# Altium schematic sheet BusDistribution.SchDoc
size A
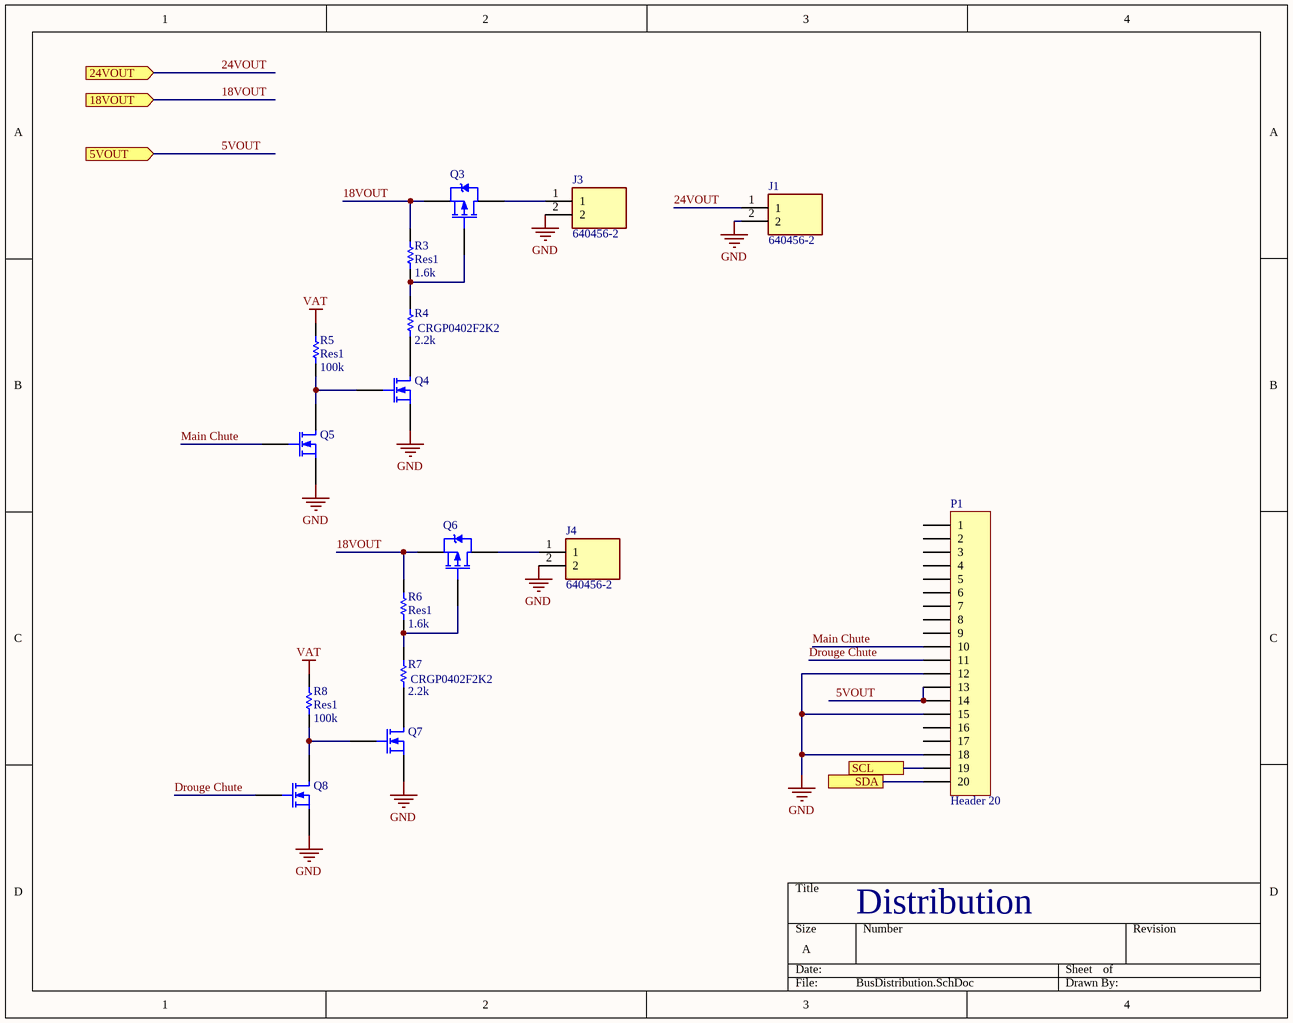
[diagram p0: BusDistribution.SchDoc]

## Parts
J1  640456-2  [16404562]
J3  640456-2  [16404562]
J4  640456-2  [16404562]
P1  Header 20  [HDR1X20]
Q3  MED power PMOS  [SOT23_L]  (value not drawn)
Q4  Low Power NMOS  [SOT23_L]  (value not drawn)
Q5  Low power NMOS  [SOT23_L]  (value not drawn)
Q6  MED power PMOS  [SOT23_L]  (value not drawn)
Q7  Low Power NMOS  [SOT23_L]  (value not drawn)
Q8  Low Power NMOS  [SOT23_L]  (value not drawn)
R3  Res1  value 1.6k  [0402]
R4  CRGP0402F2K2  value 2.2k  [0402]
R5  Res1  value 100k  [0402]
R6  Res1  value 1.6k  [0402]
R7  CRGP0402F2K2  value 2.2k  [0402]
R8  Res1  value 100k  [0402]

## Ports
5VOUT (in), 18VOUT (in), 24VOUT (in), SCL, SDA

## Nets
GND: J1.2 J3.2 J4.2 P1.12 P1.15 P1.18 Q4.3(S) Q5.3(S) Q7.3(S) Q8.3(S)
VAT: R5.2 R8.2
5VOUT: P1.13 P1.14 ; port 5VOUT
18VOUT: Q3.3(S) Q6.3(S) R3.2 R6.2 ; port 18VOUT
24VOUT: J1.1 ; port 24VOUT
Drouge Chute: P1.11 Q8.2(G)
Main Chute: P1.10 Q5.2(G)
SCL: P1.19 ; port SCL
SDA: P1.20 ; port SDA
NetJ3_1: J3.1 Q3.2(D)
NetJ4_1: J4.1 Q6.2(D)
NetQ3_1: Q3.1(G) R3.1 R4.2
NetQ4_1: Q4.1(D) R4.1
NetQ4_2: Q4.2(G) Q5.1(D) R5.1
NetQ6_1: Q6.1(G) R6.1 R7.2
NetQ7_1: Q7.1(D) R7.1
NetQ7_2: Q7.2(G) Q8.1(D) R8.1

Not connected (* = marked no-connect by the designer): P1 1 2 3 4 5 6 7 8 9 16 17

## Notes on the sheet
- Distribution

## Library data of the parts
J1 J3 J4 = 640456-2: Connector; Manufacturer_Name: TE Connectivity; Allied_Number: 70083642; Datasheet Link: http://www.te.com/commerce/DocumentDelivery/DDEController?Action=showdoc&DocId=Customer+Drawing%7F640456%7FW3%7Fpdf%7FEnglish%7FENG_CD_640456_W3.pdf%7F640456-2; Height: 7.747mm; Manufacturer_Part_Number: 640456-2; Mouser Part Number: 571-6404562; Mouser Price/Stock: https://www.mouser.com/Search/Refine.aspx?Keyword=571-6404562; RS Part Number: 1320355P; RS Price/Stock: http://uk.rs-online.com/web/p/products/1320355P; Allied Price/Stock: https://www.alliedelec.com/te-connectivity-640456-2/70083642/
P1 = Header 20: Header, 20-Pin; LatestRevisionDate: 17-Jul-2002; LatestRevisionNote: Re-released for DXP Platform.; Publisher: Altium Limited
Q3 Q6 = PMOS-2: P-Channel Power MOSFET; Note: Pin 4 not drawn and electrically connected to Pin 2.; Published: 8-Jun-2000; LatestRevisionDate: 17-Jul-2002; LatestRevisionNote: Re-released for DXP Platform.; DatasheetVersion: PD-9.390D; PackageVersion: Feb-1997; PackageReference: TO-220AB; Publisher: Altium Limited; PackageDescription: TO, Thru-Hole, Vertical, Heatsink Mounted; 3 In-Line Leads; Pitch 2.54 mm; ComponentLink1Description: Manufacturer Link; ComponentLink1URL: http://www.irf.com/
Q4 Q5 Q7 Q8 = MOSFET-N: N-Channel MOSFET; Published: 8-Jun-2000; LatestRevisionDate: 17-Jul-2002; LatestRevisionNote: Re-released for DXP Platform.; PackageVersion: 1995/1996; PackageReference: E3; Publisher: Altium Limited; PackageDescription: TO, Flat Index; 3 In-Line, Axial Leads; Body Dia. 4.6mm; Lead Dia. 0.5 mm (max)
R3 R5 R6 R8 = Res1: Resistor; Published: 8-Jun-2000; LatestRevisionDate: 17-Jul-2002; LatestRevisionNote: Re-released for DXP Platform.; PackageReference: AXIAL-0.3; Publisher: Altium Limited; PackageDescription: Axial Device, Thru-Hole; 2 Leads; 0.3 in Pin Spacing
R4 R7 = Res1: 2.2 kOhms ±1% 0.125W, 1/8W Chip Resistor 0402 (1005 Metric) Pulse Withstanding Thick Film; MFG: TE Connectivity Passive Product; MFG PN: CRGP0402F2K2